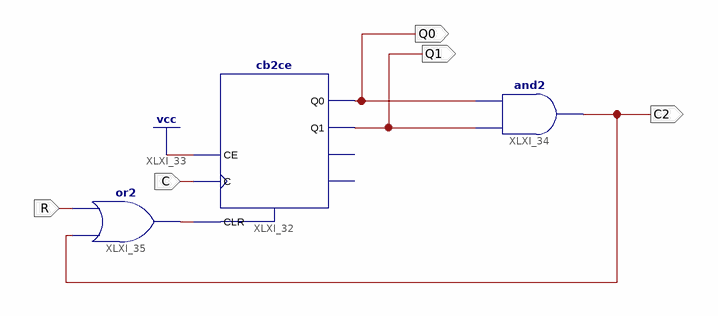
[diagram p0: schematic sheet 1]
// Xilinx ISE schematic conta2.sch (spartan3e) as structural Verilog: 3 symbols, 5 ports
module conta2 (
  input  C,
  input  R,
  output Q1,
  output Q0,
  output C2
);

  wire XLXN_56;

  cb2ce XLXI_32 (.C(C), .CE(1'b1), .CLR(XLXN_56), .Q0(Q0), .Q1(Q1));  // open: CEO, TC
  and XLXI_34 (C2, Q1, Q0);
  or XLXI_35 (XLXN_56, C2, R);
endmodule
